# Altium schematic sheet SCH_SteamShower.SchDoc
size A3
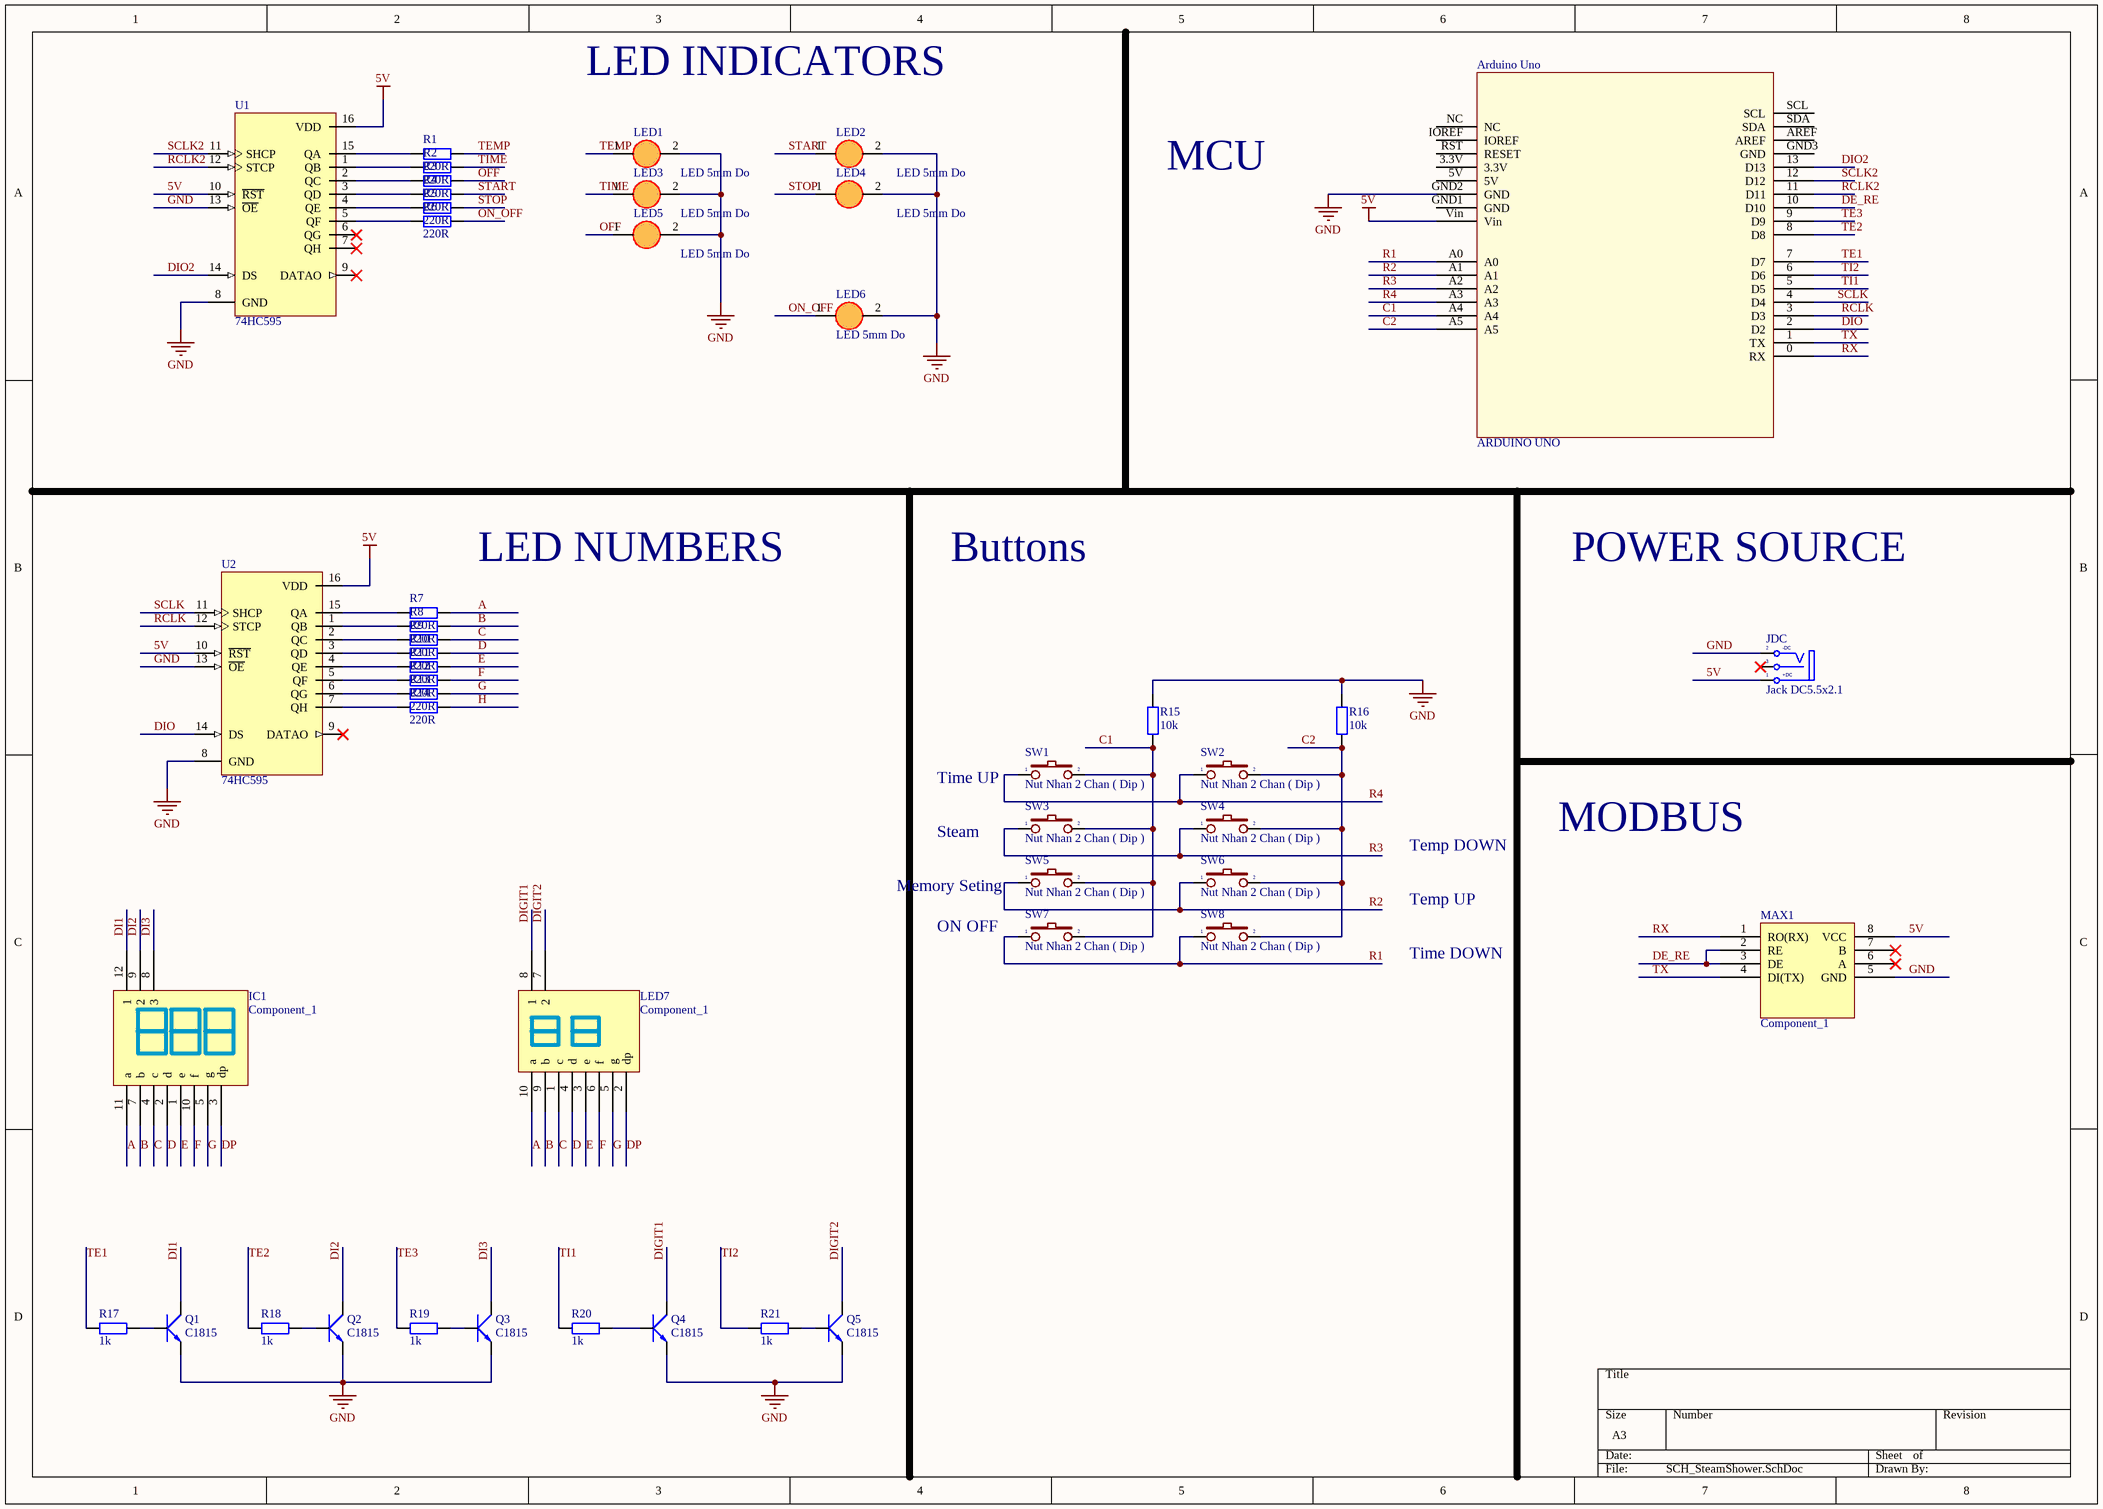
[diagram p0: SCH_SteamShower.SchDoc]

## Parts
Arduino_Uno  ARDUINO UNO  [ARDUINO UNO]
IC1  Component_1  [7SEG_MPX3]
JDC  Jack DC5.5x2.1  [DC-IN]
LED1  LED 5mm Do  [LED 5mm DO]
LED2  LED 5mm Do  [LED 5mm DO]
LED3  LED 5mm Do  [LED 5mm DO]
LED4  LED 5mm Do  [LED 5mm DO]
LED5  LED 5mm Do  [LED 5mm DO]
LED6  LED 5mm Do  [LED 5mm DO]
LED7  Component_1  [5621AS_Lib]
MAX1  Component_1  [MAX485_Module]
Q1  C1815  [QTO-92]
Q2  C1815  [QTO-92]
Q3  C1815  [QTO-92]
Q4  C1815  [QTO-92]
Q5  C1815  [QTO-92]
R1  220R  [tro vach 1/4w]
R2  220R  [tro vach 1/4w]
R3  220R  [tro vach 1/4w]
R4  220R  [tro vach 1/4w]
R5  220R  [tro vach 1/4w]
R6  220R  [tro vach 1/4w]
R7  220R  [tro vach 1/4w]
R8  220R  [tro vach 1/4w]
R9  220R  [tro vach 1/4w]
R10  220R  [tro vach 1/4w]
R11  220R  [tro vach 1/4w]
R12  220R  [tro vach 1/4w]
R13  220R  [tro vach 1/4w]
R14  220R  [tro vach 1/4w]
R15  10k  [tro vach 1/4w]
R16  10k  [tro vach 1/4w]
R17  1k  [tro vach 1/4w]
R18  1k  [tro vach 1/4w]
R19  1k  [tro vach 1/4w]
R20  1k  [tro vach 1/4w]
R21  1k  [tro vach 1/4w]
SW1  Nut Nhan 2 Chan ( Dip )  [SW2]
SW2  Nut Nhan 2 Chan ( Dip )  [SW2]
SW3  Nut Nhan 2 Chan ( Dip )  [SW2]
SW4  Nut Nhan 2 Chan ( Dip )  [SW2]
SW5  Nut Nhan 2 Chan ( Dip )  [SW2]
SW6  Nut Nhan 2 Chan ( Dip )  [SW2]
SW7  Nut Nhan 2 Chan ( Dip )  [SW2]
SW8  Nut Nhan 2 Chan ( Dip )  [SW2]
U1  74HC595  [DIP16/W0.3]
U2  74HC595  [DIP16/W0.3]

## Nets
5V: Arduino_Uno.Vin JDC.1(T) MAX1.8(VCC) U1.10(~{RST}) U1.16(VDD) U2.10(~{RST}) U2.16(VDD)
GND: Arduino_Uno.GND2(GND) JDC.2(TN) LED1.2(K) LED2.2(K) LED3.2(K) LED4.2(K) LED5.2(K) LED6.2(K) MAX1.5(GND) Q1.3(E) Q2.3(E) Q3.3(E) Q4.3(E) Q5.3(E) R15.2 R16.2 U1.8(GND) U1.13(~{OE}) U2.8(GND) U2.13(~{OE})
A: IC1.11(a) LED7.10(a) R7.2
B: IC1.7(b) LED7.9(b) R8.2
C: IC1.4(c) LED7.1(c) R9.2
C1: Arduino_Uno.A4 R15.1 SW1.2 SW3.2 SW5.2 SW7.2
C2: Arduino_Uno.A5 R16.1 SW2.2 SW4.2 SW6.2 SW8.2
D: IC1.2(d) LED7.4(d) R10.2
DE_RE: Arduino_Uno.10(D10) MAX1.2(RE) MAX1.3(DE)
DI1: IC1.12(1) Q1.2(C)
DI2: IC1.9(2) Q2.2(C)
DI3: IC1.8(3) Q3.2(C)
DIGIT1: LED7.8(1) Q4.2(C)
DIGIT2: LED7.7(2) Q5.2(C)
DIO: Arduino_Uno.2(D2) U2.14(DS)
DIO2: Arduino_Uno.13(D13) U1.14(DS)
DP: IC1.3(dp) LED7.2(dp)
E: IC1.1(e) LED7.3(e) R11.2
F: IC1.10(f) LED7.6(f) R12.2
G: IC1.5(g) LED7.5(g) R13.2
H: R14.2
OFF: LED5.1(A) R3.2
ON_OFF: LED6.1(A) R6.2
R1: Arduino_Uno.A0 SW7.1 SW8.1
R2: Arduino_Uno.A1 SW5.1 SW6.1
R3: Arduino_Uno.A2 SW3.1 SW4.1
R4: Arduino_Uno.A3 SW1.1 SW2.1
RCLK: Arduino_Uno.3(D3) U2.12(STCP)
RCLK2: Arduino_Uno.11(D11) U1.12(STCP)
RX: Arduino_Uno.0(RX) MAX1.1(RO(RX))
SCLK: Arduino_Uno.4(D4) U2.11(SHCP)
SCLK2: Arduino_Uno.12(D12) U1.11(SHCP)
START: LED2.1(A) R4.2
STOP: LED4.1(A) R5.2
TE1: Arduino_Uno.7(D7) R17.1
TE2: Arduino_Uno.8(D8) R18.1
TE3: Arduino_Uno.9(D9) R19.1
TEMP: LED1.1(A) R1.2
TI1: Arduino_Uno.5(D5) R20.1
TI2: Arduino_Uno.6(D6) R21.1
TIME: LED3.1(A) R2.2
TX: Arduino_Uno.1(TX) MAX1.4(DI(TX))
NetQ1_1: Q1.1(B) R17.2
NetQ2_1: Q2.1(B) R18.2
NetQ3_1: Q3.1(B) R19.2
NetQ4_1: Q4.1(B) R20.2
NetQ5_1: Q5.1(B) R21.2
NetR1_1: R1.1 U1.15(QA)
NetR2_1: R2.1 U1.1(QB)
NetR3_1: R3.1 U1.2(QC)
NetR4_1: R4.1 U1.3(QD)
NetR5_1: R5.1 U1.4(QE)
NetR6_1: R6.1 U1.5(QF)
NetR7_1: R7.1 U2.15(QA)
NetR8_1: R8.1 U2.1(QB)
NetR9_1: R9.1 U2.2(QC)
NetR10_1: R10.1 U2.3(QD)
NetR11_1: R11.1 U2.4(QE)
NetR12_1: R12.1 U2.5(QF)
NetR13_1: R13.1 U2.6(QG)
NetR14_1: R14.1 U2.7(QH)

Not connected (* = marked no-connect by the designer): Arduino_Uno 3.3V 5V AREF GND1(GND) GND3(GND) IOREF NC RST(RESET) SCL SDA; JDC 3(S)*; MAX1 6(A)* 7(B)*; U1 6(QG)* 7(QH)* 9(DATAO)*; U2 9(DATAO)*

## Notes on the sheet
- LED INDICATORS
- MCU
- LED NUMBERS
- Buttons
- POWER SOURCE
- Time UP
- Steam
- Temp DOWN
- MODBUS
- (near SW5) Memory Seting
- Temp UP
- ON OFF
- Time DOWN
- (in symbol Jac_DC) -DC; +DC

## Library data of the parts
IC1 = Component_1: 5631AS LED 7 Segment 3 digits
JDC = Jac_DC: Cắm; Ten_Linh_Kien: Jack DC5.5x2.1MM DC5501; Ma_Hang: MH000923; Don_Vi: Con; Kieu_Chan: *; Ghi_Chu: *; Chung_Loai: Cắm
LED1-LED6 = LED 5mm Do: Cắm; Ten_Linh_Kien: LED 3MM Xanh Lá ( SS); Ma_Hang: MH004935; Don_Vi: Con; Ghi_Chu: *; Kieu_Chan: *; Chung_Loai: Cắm
Q1-Q5 = C1815: Dán; Ten_Linh_Kien: C1815 SOT23 TRANS NPN 0.15A 50V (SMD-HF); Don_Vi: Con; Ma_Hang: MH000946; Ghi_Chu: *; Kieu_Chan: *; Chung_Loai: Dán
R1-R14 = Tro Vach 1/4W 5% 220R: Cắm; Don_Vi: Con; So_Chan: 2; Ten_Linh_Kien: Trở Vạch 1/4w 5% 220R; Ma_Hang: MH007300; Chung_Loai: Cắm; Kieu_Chan: *
R15 R16 = Tro Vach 1/4W 5% 10k: Căm; Chung_Loai: Cắm; Don_Vi: Con; So_Chan: 2; Ten_Linh_Kien: Trở Vạch 1/4w 5% 10K; Ma_Hang: MH007354; Kieu_Chan: *
R17-R21 = Tro Vach 1/4W 5% 1k: Cắm; Don_Vi: Con; So_Chan: 2; Ten_Linh_Kien: Trở Vạch 1/4w 5% 1k; Ma_Hang: MH007390; Chung_Loai: Cắm; Kieu_Chan: *
SW1-SW8 = Nut Nhan 2 Chan ( Dip ): Cắm; Ten_Linh_Kien: Nút Nhấn 2 Chân 6x6x5MM DIP; Ma_Hang: MH001959; Don_Vi: Con; Kieu_Chan: *; Ghi_Chu: *; Chung_Loai: Cắm
U1 U2 = 74HC595: Dán; Ten_Linh_Kien: 74HC595D SOP16; Don_Vi: Con; Ma_Hang: MH000672; Ghi_Chu: *; Kieu_Chan: *; Chung_Loai: Dán